# Altium project ZynqCarrierBoard.PrjPcb
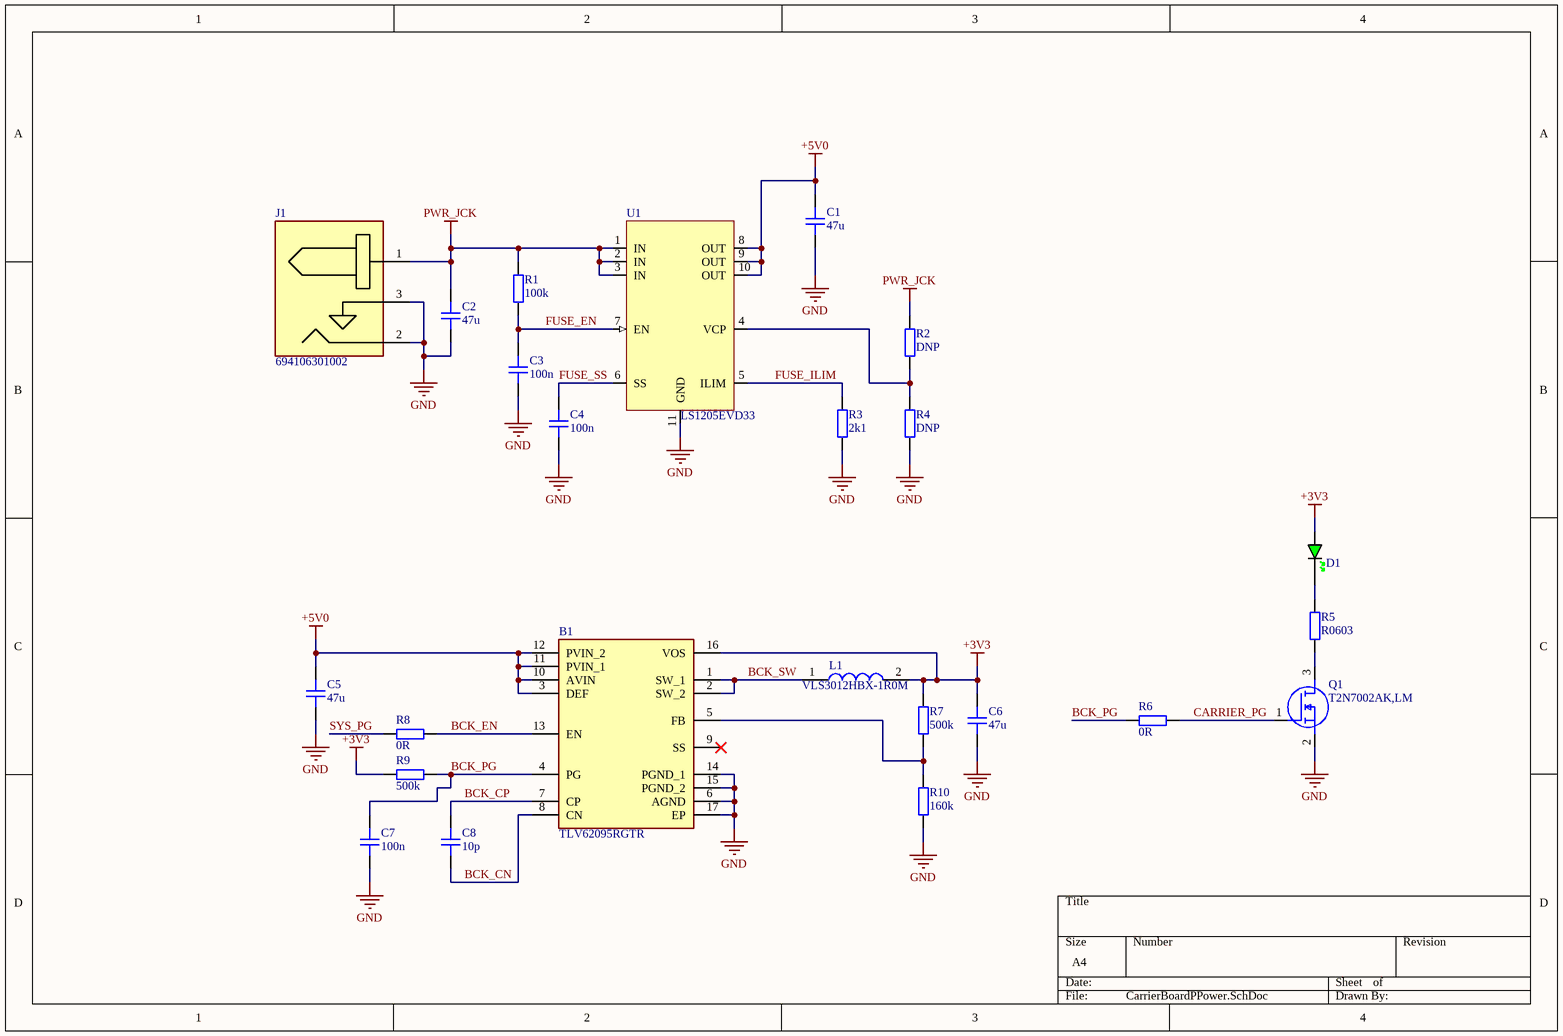
[diagram p0: CarrierBoardPPower.SchDoc]
3 sheets, 76 parts. Net scope: global (net labels, ports and power ports of the same name join across sheets).
Board file: CarrierPCBDesign.PcbDoc
Sheets:
  CarrierBoardPPower.SchDoc
  CarrierMezzanineConnectors.SchDoc
  CarrierPeripherals.SchDoc

## Sheet CarrierBoardPPower.SchDoc
size A4; SheetNumber: 1; SheetTotal: 3

### Parts
B1  TLV62095RGTR  [QFN50P300X300X100-17N-D]
C1  47u  [CAP_1210]
C2  47u  [CAP_1210]
C3  100n  [CAP_0402]
C4  100n  [CAP_0402]
C5  47u  [CAP_1210]
C6  47u  [CAP_1210]
C7  100n  [CAP_0402]
C8  10p  [CAP_0402]
D1  GREEN  [LED_0603_GREEN]  (value not drawn)
J1  694106301002  [694106301002_1]
L1  VLS3012HBX-1R0M  [VLS3012]
Q1  T2N7002AK,LM  [TBAT54CLM]
R1  100k  [RES_0603]
R2  DNP  [RES_0603]
R3  2k1  [RES_0402]
R4  DNP  [RES_0603]
R5  R0603  [RES_0603]
R6  0R  [RES_0402]
R7  500k  [RES_0402]
R8  0R  [RES_0402]
R9  500k  [RES_0402]
R10  160k  [RES_0402]
U1  LS1205EVD33  [DFN3x3_10L]

### Nets
+3V3: B1.16(VOS) C6.2 D1.A L1.2 R7.2 R9.2
+5V0: B1.3(DEF) B1.10(AVIN) B1.11(PVIN_1) B1.12(PVIN_2) C1.2 C5.2 U1.8(OUT) U1.9(OUT) U1.10(OUT)
GND: B1.6(AGND) B1.14(PGND_1) B1.15(PGND_2) B1.17(EP) C1.1 C2.1 C3.1 C4.1 C5.1 C6.1 C7.1 J1.2 J1.3 Q1.2(S) R3.1 R4.1 R10.1 U1.11(GND)
PWR_JCK: C2.2 J1.1 R1.2 R2.2 U1.1(IN) U1.2(IN) U1.3(IN)
BCK_CN: B1.8(CN) C8.1
BCK_CP: B1.7(CP) C8.2
BCK_EN: B1.13(EN) R8.1
BCK_PG: B1.4(PG) C7.2 R6.2 R9.1
BCK_SW: B1.1(SW_1) B1.2(SW_2) L1.1
CARRIER_PG: Q1.1(G) R6.1
FUSE_EN: C3.2 R1.1 U1.7(EN)
FUSE_ILIM: R3.2 U1.5(ILIM)
FUSE_SS: C4.2 U1.6(SS)
SYS_PG: R8.2
NetB1_5: B1.5(FB) R7.1 R10.2
NetD1_K: D1.K R5.2
NetQ1_3: Q1.3(D) R5.1
NetR2_1: R2.1 R4.2 U1.4(VCP)

Not connected (* = marked no-connect by the designer): B1 9(SS)*

### Library data of the parts
B1 = TLV62095RGTR: 4A Synchronous Step Down Converter with DCS Control; Manufacturer_Name: Texas Instruments; Geometry.Height: 1mm; Mouser Part Number: 595-TLV62095RGTR; Mouser Price/Stock: https://www.mouser.co.uk/ProductDetail/Texas-Instruments/TLV62095RGTR?qs=f4l5qYp%2Fy%252B5FMQoaGbkQ%252Bg%3D%3D; Manufacturer_Part_Number: TLV62095RGTR; Datasheet Link: http://www.ti.com/lit/gpn/TLV62095
C1 C2 C5 C6 = CAP_1210: Capacitor SMD 1210; Manufacturer: *; Manufacturer Part Number: *; Distributor Link: *; LCSC: *; Rating: *; Dielectric: *
C3 C4 C7 C8 = CAP_0402: Capacitor SMD 0402; Manufacturer: *; Manufacturer Part Number: *; Distributor Link: *; LCSC: *; Rating: *; Dielectric: *
D1 = LED_0603_GREEN: LED 0603 GREEN SMD
J1 = 694106301002: Connector; Manufacturer_Name: Wurth Elektronik; Datasheet Link: https://datasheet.datasheetarchive.com/originals/distributors/Datasheets_SAMA/1c153bd2ba42bb51bda59ee4cd9765cd.pdf; Manufacturer_Part_Number: 694106301002; Mouser Part Number: 710-694106301002; Mouser Price/Stock: https://www.mouser.co.uk/ProductDetail/Wurth-Elektronik/694106301002?qs=a9WhcLg8qCwOEkcI62k5mA%3D%3D
L1 = VLS3012HBX-1R0M: Inductor; Manufacturer_Name: TDK; Datasheet Link: https://product.tdk.com/system/files/dam/doc/product/inductor/inductor/smd/catalog/inductor_commercial_power_vls3012hbx_en.pdf; Manufacturer_Part_Number: VLS3012HBX-1R0M; Mouser Part Number: 810-VLS3012HBX-1R0M; Mouser Price/Stock: https://www.mouser.co.uk/ProductDetail/TDK/VLS3012HBX-1R0M?qs=pfd5qewlna4O71VRfcrI8g%3D%3D; Arrow Part Number: VLS3012HBX-1R0M; Arrow Price/Stock: https://www.arrow.com/en/products/vls3012hbx-1r0m/tdk?region=nac
Q1 = T2N7002AK,LM: MOSFET (N-Channel); Manufacturer_Name: Toshiba; Datasheet Link: http://toshiba.semicon-storage.com/info/docget.jsp?did=29712&prodName=T2N7002AK; Height: 1.1mm; Manufacturer_Part_Number: T2N7002AK,LM; Mouser Part Number: 757-T2N7002AKLM; Mouser Price/Stock: https://www.mouser.co.uk/ProductDetail/Toshiba/T2N7002AKLM?qs=pzVvXTvk9PzfX4hYglwZ9Q%3D%3D; Arrow Part Number: T2N7002AK,LM; Arrow Price/Stock: https://www.arrow.com/en/products/t2n7002aklm/toshiba?region=nac
R1 R2 R4 R5 = RES_0603: Resistor SMD 0603; Manufacturer: *; Manufacturer Part Number: *; Distributor Link: *; LCSC: *
R3 R6-R10 = RES_0402: Resistor SMD 0402; Manufacturer: *; Manufacturer Part Number: *; Distributor Link: *; LCSC: *
U1 = LS1205EVD33: 18V, 5A eFuse with Programmable Current Limit and Output Voltage Clamp; Manufacturer: Littelfuse; Manufacturer Part Number: LS1205EVD33

## Sheet CarrierMezzanineConnectors.SchDoc
size A3; SheetNumber: 2; SheetTotal: 3
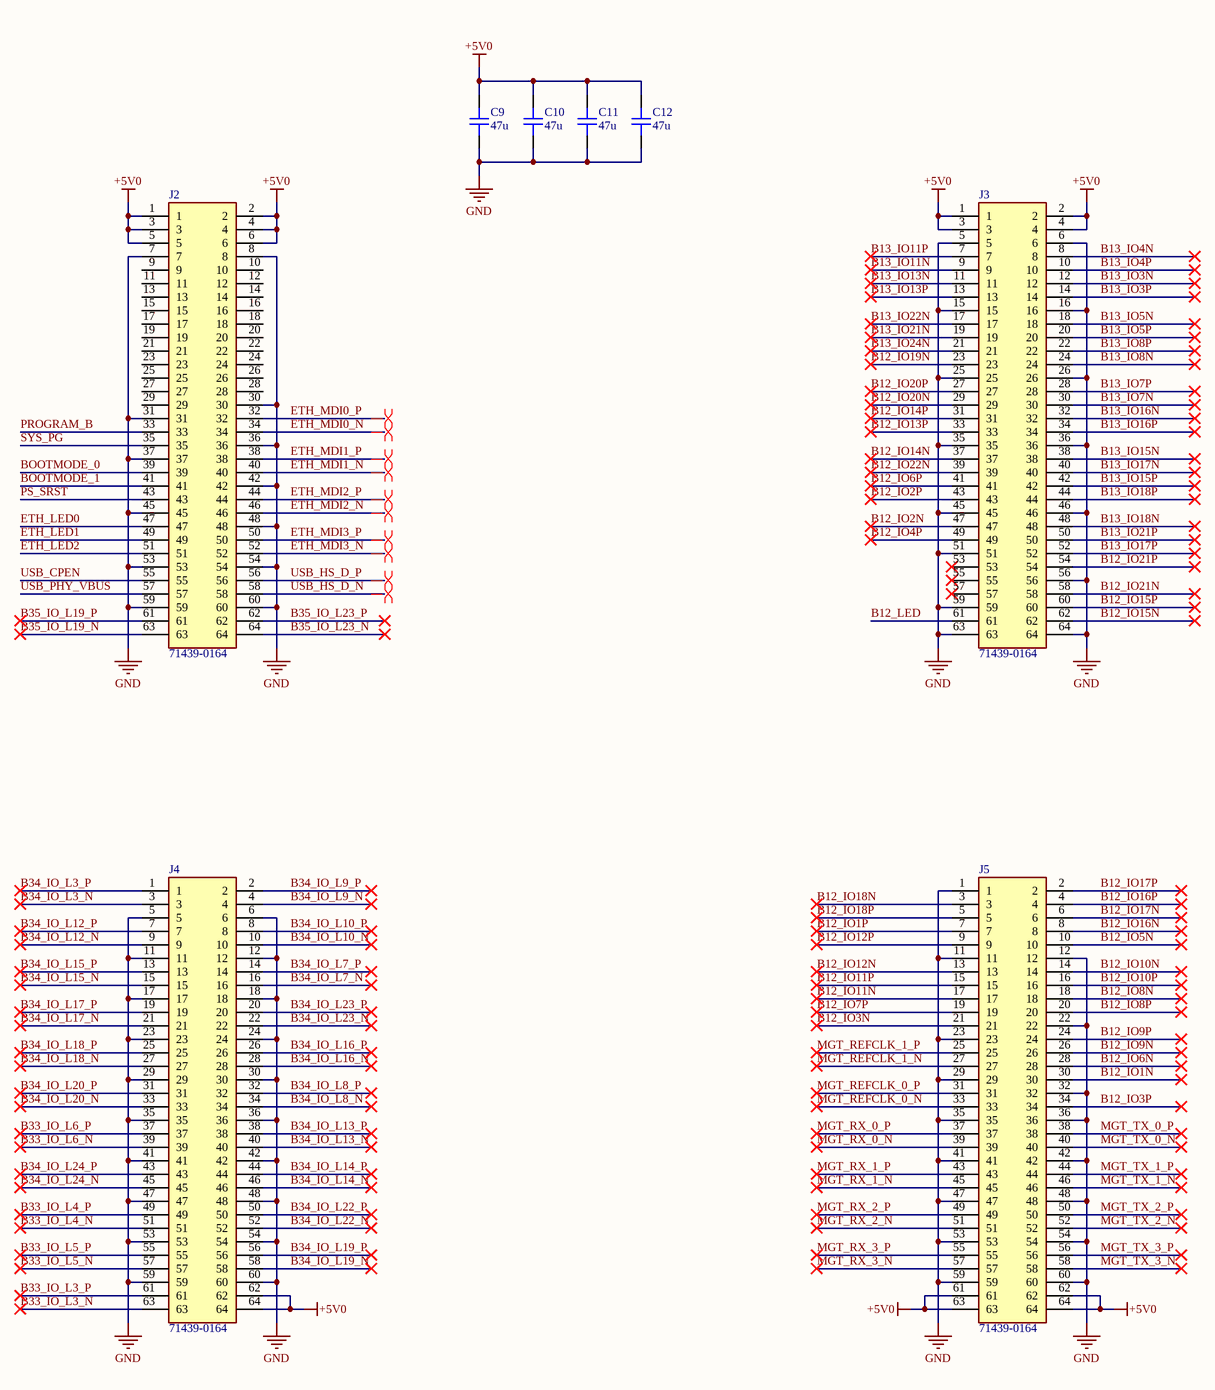
[diagram p1: CarrierMezzanineConnectors.SchDoc]

### Parts
C9  47u  [CAP_1210]
C10  47u  [CAP_1210]
C11  47u  [CAP_1210]
C12  47u  [CAP_1210]
J2  71439-0164  [714390164]
J3  71439-0164  [714390164]
J4  71439-0164  [714390164]
J5  71439-0164  [714390164]

### Nets
+5V0: C9.2 C10.2 C11.2 C12.2 J2.1 J2.2 J2.3 J2.4 J2.5 J2.6 J3.1 J3.2 J3.3 J3.4 J4.62 J4.64 J5.61 J5.62 J5.63 J5.64
GND: C9.1 C10.1 C11.1 C12.1 J2.7 J2.8 J2.30 J2.31 J2.36 J2.37 J2.42 J2.45 J2.48 J2.53 J2.54 J2.59 J2.60 J3.5 J3.6 J3.15 J3.16 J3.25 J3.26 J3.35 J3.36 J3.45 J3.46 J3.51 J3.56 J3.59 J3.63 J3.64 J4.5 J4.6 J4.11 J4.12 J4.17 J4.18 J4.23 J4.24 J4.29 J4.30 J4.35 J4.36 J4.41 J4.42 J4.47 J4.48 J4.53 J4.54 J4.59 J4.60 J5.1 J5.11 J5.12 J5.22 J5.23 J5.29 J5.32 J5.35 J5.36 J5.41 J5.42 J5.47 J5.48 J5.53 J5.54 J5.59 J5.60
B12_IO1N: J5.30
B12_IO1P: J5.7
B12_IO2N: J3.47
B12_IO2P: J3.43
B12_IO3N: J5.21
B12_IO3P: J5.34
B12_IO4P: J3.49
B12_IO5N: J5.10
B12_IO6N: J5.28
B12_IO6P: J3.41
B12_IO7P: J5.19
B12_IO8N: J5.18
B12_IO8P: J5.20
B12_IO9N: J5.26
B12_IO9P: J5.24
B12_IO10N: J5.14
B12_IO10P: J5.16
B12_IO11N: J5.17
B12_IO11P: J5.15
B12_IO12N: J5.13
B12_IO12P: J5.9
B12_IO13P: J3.33
B12_IO14N: J3.37
B12_IO14P: J3.31
B12_IO15N: J3.62
B12_IO15P: J3.60
B12_IO16N: J5.8
B12_IO16P: J5.4
B12_IO17N: J5.6
B12_IO17P: J5.2
B12_IO18N: J5.3
B12_IO18P: J5.5
B12_IO19N: J3.23
B12_IO20N: J3.29
B12_IO20P: J3.27
B12_IO21N: J3.58
B12_IO21P: J3.54
B12_IO22N: J3.39
B12_LED: J3.61
B13_IO3N: J3.12
B13_IO3P: J3.14
B13_IO4N: J3.8
B13_IO4P: J3.10
B13_IO5N: J3.18
B13_IO5P: J3.20
B13_IO7N: J3.30
B13_IO7P: J3.28
B13_IO8N: J3.24
B13_IO8P: J3.22
B13_IO11N: J3.9
B13_IO11P: J3.7
B13_IO13N: J3.11
B13_IO13P: J3.13
B13_IO15N: J3.38
B13_IO15P: J3.42
B13_IO16N: J3.32
B13_IO16P: J3.34
B13_IO17N: J3.40
B13_IO17P: J3.52
B13_IO18N: J3.48
B13_IO18P: J3.44
B13_IO21N: J3.19
B13_IO21P: J3.50
B13_IO22N: J3.17
B13_IO24N: J3.21
B33_IO_L3_N: J4.63
B33_IO_L3_P: J4.61
B33_IO_L4_N: J4.51
B33_IO_L4_P: J4.49
B33_IO_L5_N: J4.57
B33_IO_L5_P: J4.55
B33_IO_L6_N: J4.39
B33_IO_L6_P: J4.37
B34_IO_L3_N: J4.3
B34_IO_L3_P: J4.1
B34_IO_L7_N: J4.16
B34_IO_L7_P: J4.14
B34_IO_L8_N: J4.34
B34_IO_L8_P: J4.32
B34_IO_L9_N: J4.4
B34_IO_L9_P: J4.2
B34_IO_L10_N: J4.10
B34_IO_L10_P: J4.8
B34_IO_L12_N: J4.9
B34_IO_L12_P: J4.7
B34_IO_L13_N: J4.40
B34_IO_L13_P: J4.38
B34_IO_L14_N: J4.46
B34_IO_L14_P: J4.44
B34_IO_L15_N: J4.15
B34_IO_L15_P: J4.13
B34_IO_L16_N: J4.28
B34_IO_L16_P: J4.26
B34_IO_L17_N: J4.21
B34_IO_L17_P: J4.19
B34_IO_L18_N: J4.27
B34_IO_L18_P: J4.25
B34_IO_L19_N: J4.58
B34_IO_L19_P: J4.56
B34_IO_L20_N: J4.33
B34_IO_L20_P: J4.31
B34_IO_L22_N: J4.52
B34_IO_L22_P: J4.50
B34_IO_L23_N: J4.22
B34_IO_L23_P: J4.20
B34_IO_L24_N: J4.45
B34_IO_L24_P: J4.43
B35_IO_L19_N: J2.63
B35_IO_L19_P: J2.61
B35_IO_L23_N: J2.64
B35_IO_L23_P: J2.62
BOOTMODE_0: J2.39
BOOTMODE_1: J2.41
ETH_LED0: J2.47
ETH_LED1: J2.49
ETH_LED2: J2.51
ETH_MDI0_N: J2.34
ETH_MDI0_P: J2.32
ETH_MDI1_N: J2.40
ETH_MDI1_P: J2.38
ETH_MDI2_N: J2.46
ETH_MDI2_P: J2.44
ETH_MDI3_N: J2.52
ETH_MDI3_P: J2.50
MGT_REFCLK_0_N: J5.33
MGT_REFCLK_0_P: J5.31
MGT_REFCLK_1_N: J5.27
MGT_REFCLK_1_P: J5.25
MGT_RX_0_N: J5.39
MGT_RX_0_P: J5.37
MGT_RX_1_N: J5.45
MGT_RX_1_P: J5.43
MGT_RX_2_N: J5.51
MGT_RX_2_P: J5.49
MGT_RX_3_N: J5.57
MGT_RX_3_P: J5.55
MGT_TX_0_N: J5.40
MGT_TX_0_P: J5.38
MGT_TX_1_N: J5.46
MGT_TX_1_P: J5.44
MGT_TX_2_N: J5.52
MGT_TX_2_P: J5.50
MGT_TX_3_N: J5.58
MGT_TX_3_P: J5.56
PROGRAM_B: J2.33
PS_SRST: J2.43
SYS_PG: J2.35
USB_CPEN: J2.55
USB_HS_D_N: J2.58
USB_HS_D_P: J2.56
USB_PHY_VBUS: J2.57

Not connected (* = marked no-connect by the designer): J2 9 10 11 12 13 14 15 16 17 18 19 20 21 22 23 24 25 26 27 28 29; J3 53* 55* 57*

### Layout directives
differential pair: ETH_MDI0_N, ETH_MDI0_P, ETH_MDI1_N, ETH_MDI1_P, ETH_MDI2_N, ETH_MDI2_P, ETH_MDI3_N, ETH_MDI3_P, USB_HS_D_N, USB_HS_D_P

### Library data of the parts
C9-C12 = CAP_1210: Capacitor SMD 1210; Manufacturer: *; Manufacturer Part Number: *; Distributor Link: *; LCSC: *; Rating: *; Dielectric: *
J2-J5 = 71439-0164: Board to Board & Mezzanine Connectors PMC RECEPTACLE SMT; Manufacturer_Name: Molex; Datasheet Link: https://componentsearchengine.com/Datasheets/1/71439-0164.pdf; Height: 5.3mm; Manufacturer_Part_Number: 71439-0164; Mouser Part Number: 538-71439-0164; Mouser Price/Stock: https://www.mouser.co.uk/ProductDetail/Molex/71439-0164?qs=X1mjqRbeMc7uGUsAO8ttVw%3D%3D

## Sheet CarrierPeripherals.SchDoc
size A3; SheetNumber: 3; SheetTotal: 3
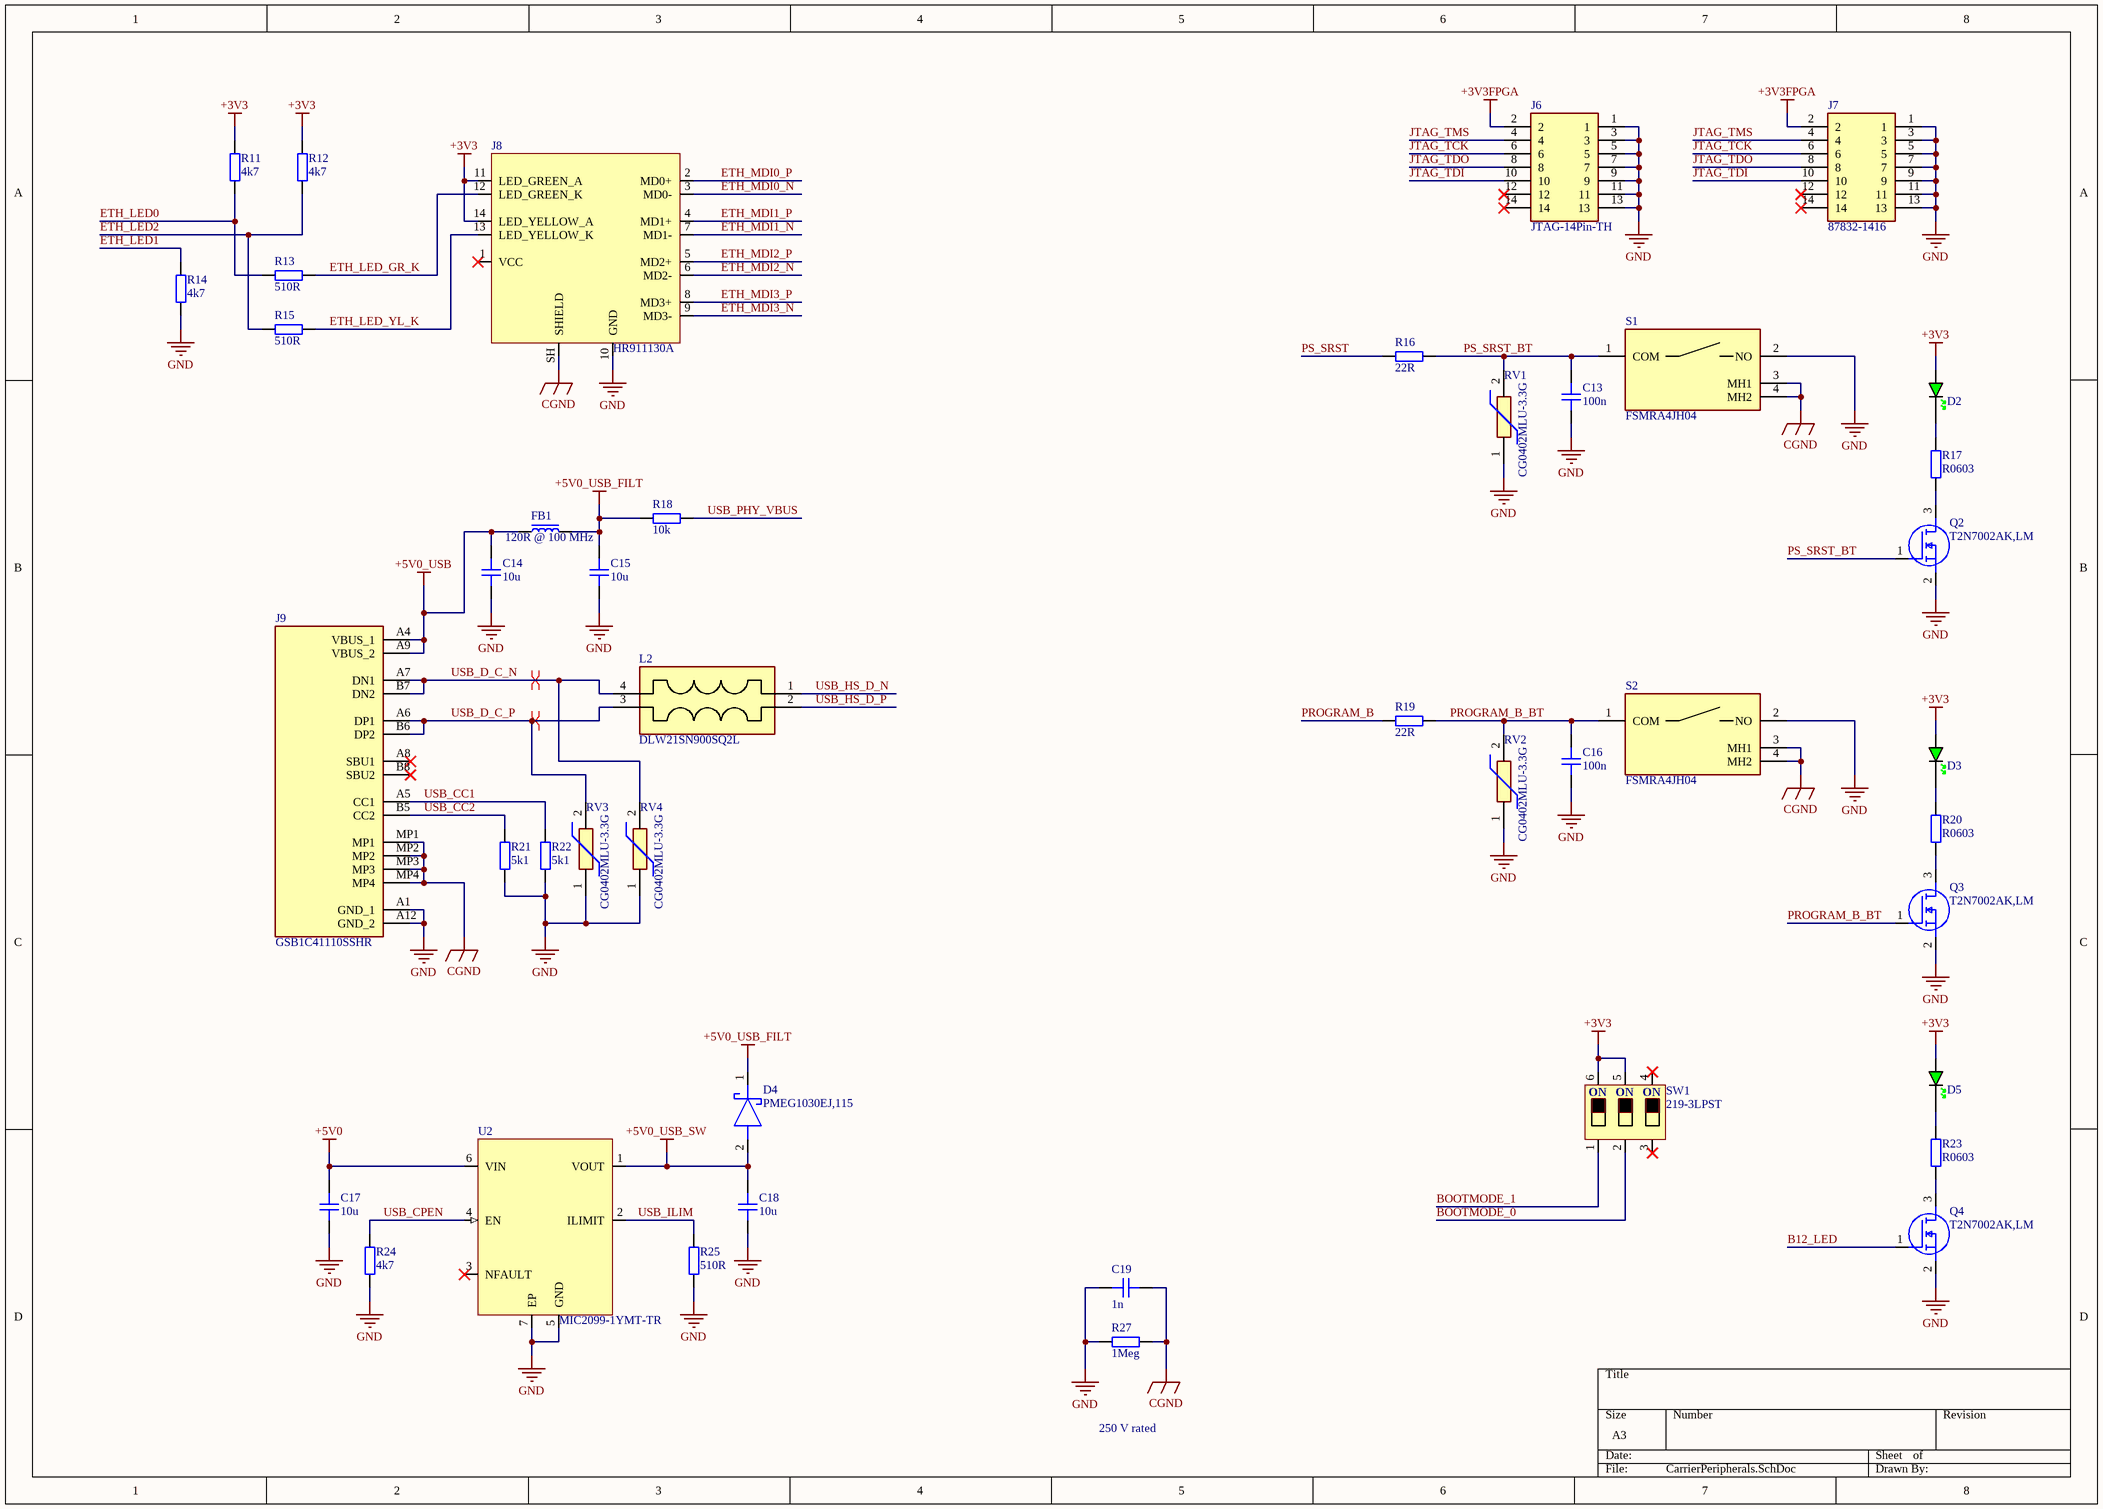
[diagram p2: CarrierPeripherals.SchDoc]

### Parts
C13  100n  [CAP_0402]
C14  10u  [CAP_0603]
C15  10u  [CAP_0603]
C16  100n  [CAP_0402]
C17  10u  [CAP_0603]
C18  10u  [CAP_0603]
C19  1n  [CAP_1206]
D2  GREEN  [LED_0603_GREEN]  (value not drawn)
D3  GREEN  [LED_0603_GREEN]  (value not drawn)
D4  PMEG1030EJ,115  [PMEG1030EJ115]
D5  GREEN  [LED_0603_GREEN]  (value not drawn)
FB1  120R @ 100 MHz  [FB_0603]
J6  JTAG-14Pin-TH  [14Pin-TH]
J7  87832-1416  [878321416]
J8  HR911130A  [HR911130A]
J9  GSB1C41110SSHR  [GSB1C41110SSHR]
L2  DLW21SN900SQ2L  [DLW21SN121HQ2L]
Q2  T2N7002AK,LM  [TBAT54CLM]
Q3  T2N7002AK,LM  [TBAT54CLM]
Q4  T2N7002AK,LM  [TBAT54CLM]
R11  4k7  [RES_0402]
R12  4k7  [RES_0402]
R13  510R  [RES_0603]
R14  4k7  [RES_0402]
R15  510R  [RES_0603]
R16  22R  [RES_0402]
R17  R0603  [RES_0603]
R18  10k  [RES_0402]
R19  22R  [RES_0402]
R20  R0603  [RES_0603]
R21  5k1  [RES_0402]
R22  5k1  [RES_0402]
R23  R0603  [RES_0603]
R24  4k7  [RES_0402]
R25  510R  [RES_0603]
R27  1Meg  [RES_1206]
RV1  CG0402MLU-3.3G  [VARC1005X41N]
RV2  CG0402MLU-3.3G  [VARC1005X41N]
RV3  CG0402MLU-3.3G  [VARC1005X41N]
RV4  CG0402MLU-3.3G  [VARC1005X41N]
S1  FSMRA4JH04  [FSMRA4JH04]
S2  FSMRA4JH04  [FSMRA4JH04]
SW1  219-3LPST  [219-3LPST]
U2  MIC2099-1YMT-TR  [TMLF-6-1_6X1_6]

### Nets
+3V3: D2.A D3.A D5.A J8.11(LED_GREEN_A) J8.14(LED_YELLOW_A) R11.2 R12.2 SW1.5 SW1.6
+3V3FPGA: J6.2 J7.2
+5V0: C17.2 U2.6(VIN)
+5V0_USB: C14.2 FB1.1 J9.A4(VBUS_1) J9.A9(VBUS_2)
+5V0_USB_FILT: C15.2 D4.1(K) FB1.2 R18.1
+5V0_USB_SW: C18.2 D4.2(A) U2.1(VOUT)
CGND: C19.2 J8.SH(SHIELD) J9.MP1 J9.MP2 J9.MP3 J9.MP4 R27.2 S1.3(MH1) S1.4(MH2) S2.3(MH1) S2.4(MH2)
GND: C13.1 C14.1 C15.1 C16.1 C17.1 C18.1 C19.1 J6.1 J6.3 J6.5 J6.7 J6.9 J6.11 J6.13 J7.1 J7.3 J7.5 J7.7 J7.9 J7.11 J7.13 J8.10(GND) J9.A1(GND_1) J9.A12(GND_2) Q2.2(S) Q3.2(S) Q4.2(S) R14.1 R21.1 R22.1 R24.1 R25.1 R27.1 RV1.1 RV2.1 RV3.1 RV4.1 S1.2(NO) S2.2(NO) U2.5(GND) U2.7(EP)
B12_LED: Q4.1(G)
BOOTMODE_0: SW1.2
BOOTMODE_1: SW1.1
ETH_LED0: R11.1 R13.1
ETH_LED1: R14.2
ETH_LED2: R12.1 R15.2
ETH_LED_GR_K: J8.12(LED_GREEN_K) R13.2
ETH_LED_YL_K: J8.13(LED_YELLOW_K) R15.1
ETH_MDI0_N: J8.3(MD0-)
ETH_MDI0_P: J8.2(MD0+)
ETH_MDI1_N: J8.7(MD1-)
ETH_MDI1_P: J8.4(MD1+)
ETH_MDI2_N: J8.6(MD2-)
ETH_MDI2_P: J8.5(MD2+)
ETH_MDI3_N: J8.9(MD3-)
ETH_MDI3_P: J8.8(MD3+)
JTAG_TCK: J6.6 J7.6
JTAG_TDI: J6.10 J7.10
JTAG_TDO: J6.8 J7.8
JTAG_TMS: J6.4 J7.4
PROGRAM_B: R19.2
PROGRAM_B_BT: C16.2 Q3.1(G) R19.1 RV2.2 S2.1(COM)
PS_SRST: R16.2
PS_SRST_BT: C13.2 Q2.1(G) R16.1 RV1.2 S1.1(COM)
USB_CC1: J9.A5(CC1) R22.2
USB_CC2: J9.B5(CC2) R21.2
USB_CPEN: R24.2 U2.4(EN)
USB_D_C_N: J9.A7(DN1) J9.B7(DN2) L2.4 RV4.2
USB_D_C_P: J9.A6(DP1) J9.B6(DP2) L2.3 RV3.2
USB_HS_D_N: L2.1
USB_HS_D_P: L2.2
USB_ILIM: R25.2 U2.2(ILIMIT)
USB_PHY_VBUS: R18.2
NetD2_K: D2.K R17.2
NetD3_K: D3.K R20.2
NetD5_K: D5.K R23.2
NetQ2_3: Q2.3(D) R17.1
NetQ3_3: Q3.3(D) R20.1
NetQ4_3: Q4.3(D) R23.1

Not connected (* = marked no-connect by the designer): J6 12* 14*; J7 12* 14*; J8 1(VCC)*; J9 A8(SBU1)* B8(SBU2)*; SW1 3* 4*; U2 3(NFAULT)*

### Layout directives
differential pair: USB_D_C_N, USB_D_C_P

### Notes on the sheet
- 250 V rated
- (in symbol 219-3LPST) ON

### Library data of the parts
C13 C16 = CAP_0402: Capacitor SMD 0402; Manufacturer: *; Manufacturer Part Number: *; Distributor Link: *; LCSC: *; Rating: *; Dielectric: *
C14 C15 C17 C18 = CAP_0603: Capacitor SMD 0603; Manufacturer: *; Manufacturer Part Number: *; Distributor Link: *; LCSC: *; Rating: *; Dielectric: *
C19 = CAP_1206: Capacitor SMD 1206; Manufacturer: *; Manufacturer Part Number: *; Distributor Link: *; LCSC: *; Rating: *; Dielectric: *
D2 D3 D5 = LED_0603_GREEN: LED 0603 GREEN SMD
D4 = PMEG1030EJ,115: Schottky Diode; Manufacturer_Name: Nexperia; Datasheet Link: https://assets.nexperia.com/documents/data-sheet/PMEG1030EH_EJ.pdf; Height: 0.8mm; Manufacturer_Part_Number: PMEG1030EJ,115; Mouser Part Number: 771-PMEG1030EJ-T/R; Mouser Price/Stock: https://www.mouser.co.uk/ProductDetail/Nexperia/PMEG1030EJ115?qs=LOCUfHb8d9vmk7P%2FuYbs5A%3D%3D; Arrow Part Number: PMEG1030EJ,115; Arrow Price/Stock: https://www.arrow.com/en/products/pmeg1030ej115/nexperia?utm_currency=USD&region=nac
FB1 = FB_0603: Ferrite Bead SMD 0603; Manufacturer: *; Manufacturer Part Number: *; Distributor Link: *; LCSC: *
J6 = JTAG-14Pin-TH: Connector; Manufacturer_Name: Molex; Manufacturer_Part_Number: 87832-1416; Datasheet Link: http://uk.rs-online.com/web/p/products/6701077; Height: 7.6mm; Mouser Part Number: 538-87832-1416; Mouser Price/Stock: https://www.mouser.co.uk/ProductDetail/Molex/87832-1416?qs=kNSQ05%252BLZoDeXuSWsnDgxQ%3D%3D
J7 = 87832-1416: Connector; Manufacturer_Name: Molex; Datasheet Link: http://uk.rs-online.com/web/p/products/6701077; Height: 7.6mm; Manufacturer_Part_Number: 87832-1416; Mouser Part Number: 538-87832-1416; Mouser Price/Stock: https://www.mouser.co.uk/ProductDetail/Molex/87832-1416?qs=kNSQ05%252BLZoDeXuSWsnDgxQ%3D%3D
J8 = HR911130A: 100/1000Base-T Magnetics Single-Port RJ45 Connector with Integrated Magnetics and LEDs; Manufacturer: Hanrun; Manufacturer Part Number: HR911130A
J9 = GSB1C41110SSHR: Connector; Manufacturer_Name: Amphenol Communications Solutions; Datasheet Link: https://cdn.amphenol-cs.com/media/wysiwyg/files/drawing/gsb1c41x10sshr-ax1.pdf; Height: 3.41mm; Manufacturer_Part_Number: GSB1C41110SSHR
L2 = DLW21SN900SQ2L: Inductor; Manufacturer_Name: Murata Electronics; Datasheet Link: https://datasheet.datasheetarchive.com/originals/distributors/Datasheets_SAMA/ece8820704b5ec0ab68e5b2fda1b5649.pdf; Height: 1.4mm; Manufacturer_Part_Number: DLW21SN900SQ2L; Mouser Part Number: 81-DLW21SN900SQ2L; Mouser Price/Stock: https://www.mouser.co.uk/ProductDetail/Murata-Electronics/DLW21SN900SQ2L?qs=yQ3nQrcaeVsNzdZbwxOhwQ%3D%3D; Arrow Part Number: DLW21SN900SQ2L; Arrow Price/Stock: https://www.arrow.com/en/products/dlw21sn900sq2l/murata-manufacturing?region=europe
Q2-Q4 = T2N7002AK,LM: as Q1 on sheet CarrierBoardPPower; Datasheet Link: http://toshiba.semicon-storage.com/info/docget.jsp?did=29712&prodName=T2N7002AK; Height: 1.1mm; Manufacturer_Part_Number: T2N7002AK,LM; Mouser Part Number: 757-T2N7002AKLM; Mouser Price/Stock: https://www.mouser.co.uk/ProductDetail/Toshiba/T2N7002AKLM?qs=pzVvXTvk9PzfX4hYglwZ9Q%3D%3D; Arrow Part Number: T2N7002AK,LM; Arrow Price/Stock: https://www.arrow.com/en/products/t2n7002aklm/toshiba?region=nac
R11 R12 R14 R16 R18 R19 R21 R22 R24 = RES_0402: Resistor SMD 0402; Manufacturer: *; Manufacturer Part Number: *; Distributor Link: *; LCSC: *
R13 R15 R17 R20 R23 R25 = RES_0603: Resistor SMD 0603; Manufacturer: *; Manufacturer Part Number: *; Distributor Link: *; LCSC: *
R27 = RES_1206: Resistor SMD 1206; Manufacturer: *; Manufacturer Part Number: *; Distributor Link: *; LCSC: *
RV1-RV4 = CG0402MLU-3.3G: ESD Diode; Manufacturer_Name: Bourns; Datasheet Link: https://www.bourns.com/docs/Product-Datasheets/MLU.pdf; Height: 0.41mm; Manufacturer_Part_Number: CG0402MLU-3.3G; Mouser Part Number: 652-CG0402MLU-3.3G; Mouser Price/Stock: https://www.mouser.co.uk/ProductDetail/Bourns/CG0402MLU-3.3G?qs=m8myXnDJXpWVM8EQWErxtQ%3D%3D; Arrow Part Number: CG0402MLU-3.3G; Arrow Price/Stock: https://www.arrow.com/en/products/cg0402mlu-3.3g/bourns?utm_currency=USD&region=nac
S1 S2 = FSMRA4JH04: Switch; Manufacturer_Name: TE Connectivity; Datasheet Link: http://www.te.com/commerce/DocumentDelivery/DDEController?Action=showdoc&DocId=Customer+Drawing%7F1825027%7FG4%7Fpdf%7FEnglish%7FENG_CD_1825027_G4.pdf%7F1-1825027-1; Height: 7.01mm; Manufacturer_Part_Number: FSMRA4JH04; Mouser Part Number: 506-FSMRA4JH04; Mouser Price/Stock: https://www.mouser.co.uk/ProductDetail/TE-Connectivity-Alcoswitch/FSMRA4JH04?qs=65SUpkGmTbapQKkEnx7SmQ%3D%3D; Arrow Part Number: FSMRA4JH04; Arrow Price/Stock: https://www.arrow.com/en/products/fsmra4jh04/te-connectivity?region=nac
SW1 = 219-3LPST: DIP Switches SPST 3x; Manufacturer: CTS; Manufacturer Part Number: 219-3LPST
U2 = MIC2099-1YMT-TR: Power Distribution Switch Resistor programmable current limit / – 0.1A to 1.1A 2.5V-5.5V; Manufacturer: Microchip; Manufacturer Part Number: MIC2099-1YMT-TR

## Nets that join several sheets
+3V3: CarrierBoardPPower (6 pins), CarrierPeripherals (9 pins)
+5V0: CarrierBoardPPower (9 pins), CarrierMezzanineConnectors (20 pins), CarrierPeripherals (C17.2 U2.6)
GND: CarrierBoardPPower (18 pins), CarrierMezzanineConnectors (69 pins), CarrierPeripherals (41 pins)
B12_LED: CarrierMezzanineConnectors (J3.61), CarrierPeripherals (Q4.1)
BOOTMODE_0: CarrierMezzanineConnectors (J2.39), CarrierPeripherals (SW1.2)
BOOTMODE_1: CarrierMezzanineConnectors (J2.41), CarrierPeripherals (SW1.1)
ETH_LED0: CarrierMezzanineConnectors (J2.47), CarrierPeripherals (R11.1 R13.1)
ETH_LED1: CarrierMezzanineConnectors (J2.49), CarrierPeripherals (R14.2)
ETH_LED2: CarrierMezzanineConnectors (J2.51), CarrierPeripherals (R12.1 R15.2)
ETH_MDI0_N: CarrierMezzanineConnectors (J2.34), CarrierPeripherals (J8.3)
ETH_MDI0_P: CarrierMezzanineConnectors (J2.32), CarrierPeripherals (J8.2)
ETH_MDI1_N: CarrierMezzanineConnectors (J2.40), CarrierPeripherals (J8.7)
ETH_MDI1_P: CarrierMezzanineConnectors (J2.38), CarrierPeripherals (J8.4)
ETH_MDI2_N: CarrierMezzanineConnectors (J2.46), CarrierPeripherals (J8.6)
ETH_MDI2_P: CarrierMezzanineConnectors (J2.44), CarrierPeripherals (J8.5)
ETH_MDI3_N: CarrierMezzanineConnectors (J2.52), CarrierPeripherals (J8.9)
ETH_MDI3_P: CarrierMezzanineConnectors (J2.50), CarrierPeripherals (J8.8)
PROGRAM_B: CarrierMezzanineConnectors (J2.33), CarrierPeripherals (R19.2)
PS_SRST: CarrierMezzanineConnectors (J2.43), CarrierPeripherals (R16.2)
SYS_PG: CarrierBoardPPower (R8.2), CarrierMezzanineConnectors (J2.35)
USB_CPEN: CarrierMezzanineConnectors (J2.55), CarrierPeripherals (R24.2 U2.4)
USB_HS_D_N: CarrierMezzanineConnectors (J2.58), CarrierPeripherals (L2.1)
USB_HS_D_P: CarrierMezzanineConnectors (J2.56), CarrierPeripherals (L2.2)
USB_PHY_VBUS: CarrierMezzanineConnectors (J2.57), CarrierPeripherals (R18.2)